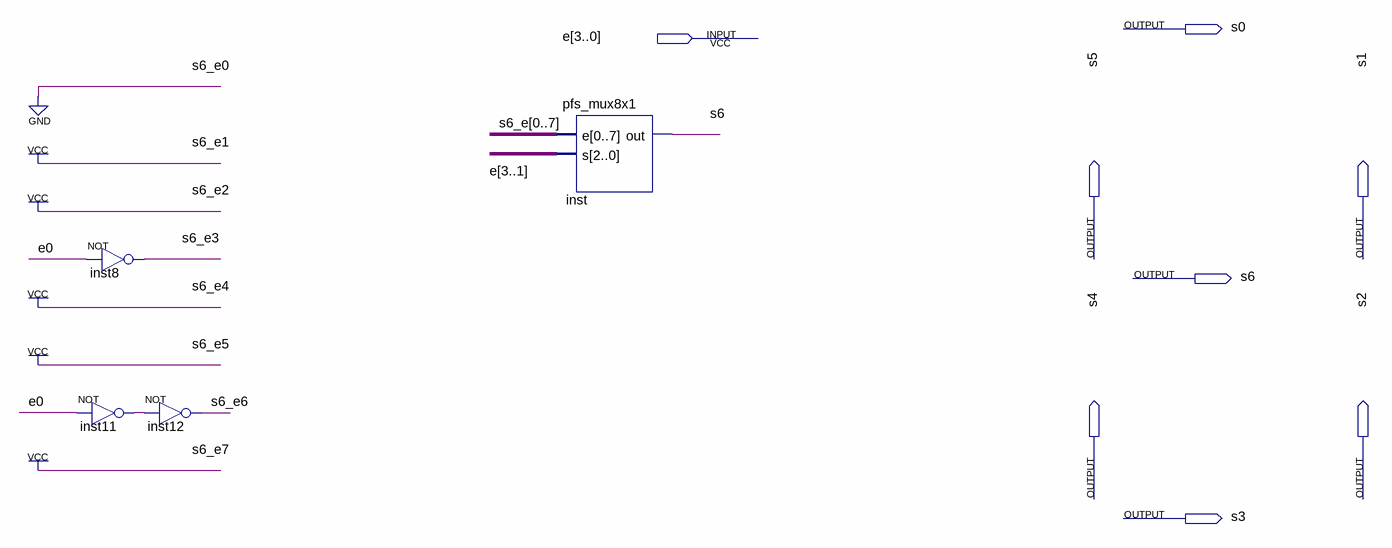
[diagram p0: schematic sheet]
// Quartus schematic pfs_display.bdf as structural Verilog: 4 symbols, 8 pins
module pfs_display (
  input  [3:0] e,
  output s0,
  output s5,
  output s1,
  output s6,
  output s4,
  output s2,
  output s3
);

  wire inst11_out;
  wire [6:3] s6_e;

  not inst8 (s6_e[3], e[0]);
  not inst11 (inst11_out, e[0]);
  not inst12 (s6_e[6], inst11_out);
  pfs_mux8x1 inst (.e({3'b011, s6_e[3], 2'b11, s6_e[6], 1'b1}), .s(e[3:1]), .out(s6));
endmodule
